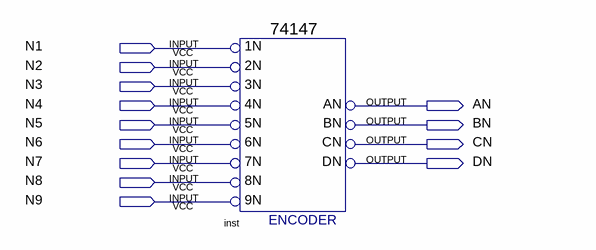
[diagram p0: schematic sheet]
// Quartus schematic test_74147.bdf as structural Verilog: 1 symbols, 13 pins
module test_74147 (
  input  N1,
  input  N2,
  input  N3,
  input  N4,
  input  N5,
  input  N6,
  input  N7,
  input  N8,
  input  N9,
  output AN,
  output BN,
  output CN,
  output DN
);

  \74147  inst (
    .\1N (N1), .\2N (N2), .\3N (N3), .\6N (N6), .\5N (N5), .\4N (N4), .\9N (N9), .\8N (N8), .\7N (N7),
    .CN(CN), .BN(BN), .AN(AN), .DN(DN));
endmodule
